# EAGLE design av-streamer-led-hat (EAGLE 9.7.0)
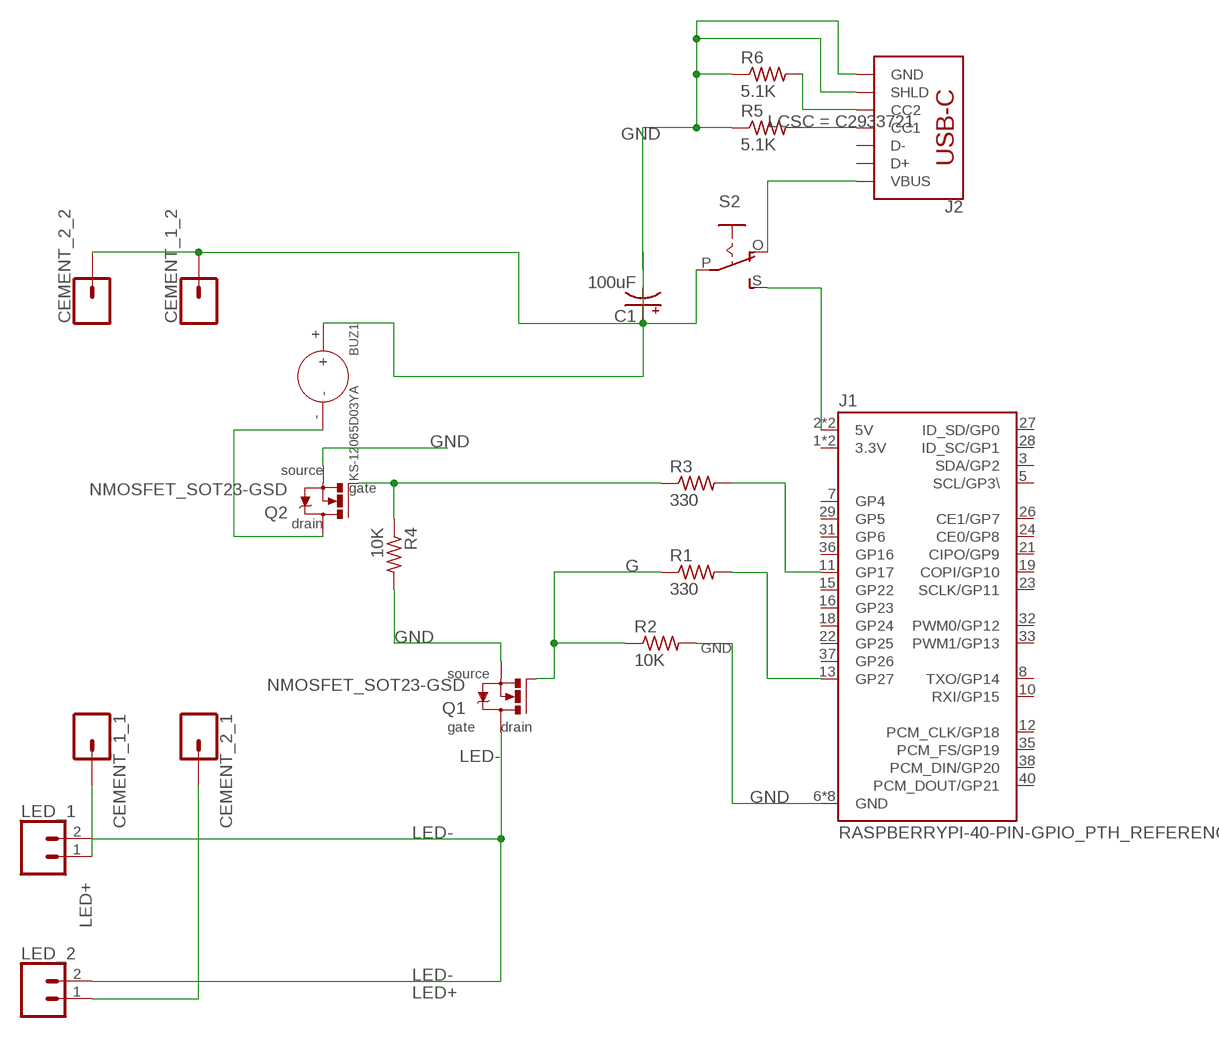
[diagram p0: schematic, sheet 1]

## Parts
BUZ1  KS-12065D03YA  DIP-BUZZER-3V(KS-12065D03YA)  [BZ2-7.6-D12.0XH6.5MM]
C1  100uF  100UF-POLAR-RADIAL-2.5MM-25V-20%  [CPOL-RADIAL-2.5MM-6.5MM]
CEMENT_1_1  CONN_01  [1X01]
CEMENT_1_2  CONN_01  [1X01]
CEMENT_2_1  CONN_01  [1X01]
CEMENT_2_2  CONN_01  [1X01]
J1  RASPBERRYPI-40-PIN-GPIO_PTH_REFERENCE  [RASPBERRY_PI_HAT_40_PIN_PTH_WITH_REFERNCE]
J2  USB_C_2-LAYER_PADS  [USB-C-16P-2LAYER-PADS]
LED_1  CONN_02  [1X02]
LED_2  CONN_02  [1X02]
Q1  NMOSFET_SOT23-GSD  [SOT23]
Q2  NMOSFET_SOT23-GSD  [SOT23]
R1  330  R-US_R1206  [R1206]
R2  10K  R-US_R1206  [R1206]
R3  330  R-US_R1206  [R1206]
R4  10K  R-US_R1206  [R1206]
R5  5.1K  R-US_R1206  [R1206]
R6  5.1K  R-US_R1206  [R1206]
S2  EG1218S  [EG1218]

## Nets
G [LED]: Q1.1(G) R1.1 R2.1
GND [POWER]: C1.2(-) J1.6(GND) J1.9(GND) J1.14(GND) J1.20(GND) J1.25(GND) J1.30(GND) J1.34(GND) J1.39(GND) J2.GND J2.GND2(GND) J2.SHLD1(SHLD) J2.SHLD2(SHLD) J2.SHLD3(SHLD) J2.SHLD4(SHLD) Q1.2(S) Q2.2(S) R2.2 R4.2 R5.1 R6.1
LED+ [LED]: CEMENT_1_1.1 CEMENT_2_1.1 LED_1.1 LED_2.1
LED- [LED]: LED_1.2 LED_2.2 Q1.3(D)
N$1: J1.11(GP17) R3.2
N$3: J1.13(GP27) R1.2
N$4: Q2.1(G) R3.1 R4.1
N$5: J2.A5(CC1) R5.2
N$6: J2.B5(CC2) R6.2
N$7: J2.VBUS1(VBUS) J2.VBUS2(VBUS) S2.O
N$8: J1.2(5V) J1.4(5V) S2.S
N$9 [POWER]: BUZ1.- Q2.3(D)
N$10 [POWER]: BUZ1.+ C1.1(+) CEMENT_1_2.1 CEMENT_2_2.1 S2.P
Unconnected: J1.3(SDA/GP2) J1.5(SCL/GP3\) J1.7(GP4) J1.8(TXO/GP14) J1.10(RXI/GP15) J1.12(PCM_CLK/GP18) J1.15(GP22) J1.16(GP23) J1.18(GP24) J1.19(COPI/GP10) J1.21(CIPO/GP9) J1.22(GP25) J1.23(SCLK/GP11) J1.24(CE0/GP8) J1.26(CE1/GP7) J1.27(ID_SD/GP0) J1.28(ID_SC/GP1) J1.29(GP5) J1.31(GP6) J1.32(PWM0/GP12) J1.33(PWM1/GP13) J1.35(PCM_FS/GP19) J1.36(GP16) J1.37(GP26) J1.38(PCM_DIN/GP20) J1.40(PCM_DOUT/GP21) J2.A6(D+) J2.A7(D-) J2.B6(D+) J2.B7(D-)

## Notes on the sheet
- source
- gate
- drain
- source
- gate | drain

## Power pins joined to a net without a drawn wire
3.3V: J1.1(3.3V) J1.17(3.3V)

## Library data of the parts
BUZ1 = OPL_Connector:DIP-BUZZER-3V(KS-12065D03YA): 312010004; MPN: KS-12065D03YA
C1 = SparkFun-Capacitors:100UF-POLAR: 100µF polarized capacitors A capacitor is a passive two-terminal electrical component used to store electrical energy temporarily in an electric field.; PROD_ID: CAP-08439
CEMENT_1_1 CEMENT_1_2 CEMENT_2_1 CEMENT_2_2 = SparkFun-Connectors:CONN_01: Single connection point. Often used as Generic Header-pin footprint for 0.1 inch spaced/style header connections On any of the 0.1 inch spaced packages, you can populate with these: Break Away Headers - Straight <https://www.sparkfun.com/products/116> (PRT-00116) Break Away Male Headers - Right Angle <https://www.sparkfun.com/products/553> (PRT-00553) Female Headers <https://www.sparkfun.com/products/115> (PRT-00115) Break Away Headers - Machine Pin <https://www.sparkfun.com/products/117> (PRT-00117) Break Away Female Headers - Swiss Machine Pin <https://www.sparkfun.com/products/743> (PRT-00743) This device is also useful as a general connection point to wire up your design to another part of your project. Our various solder wires solder well into these plated through hole pads. Hook-Up Wire - Assortment (Stranded, 22 AWG) <https://www.sparkfun.com/products/11375> (PRT-11375) Hook-Up Wire - Assortment (Solid Core, 22 AWG) <https://www.sparkfun.com/products/11367> (PRT-11367) View the entire wire category on our website here <https://www.sparkfun.com/categories/141> Special notes: SMTSO-256-ET is a "flush mount" nut for a 4-40 screw. We mostly use this on specialty testbeds; it is a nice way to connect hardware to your PCB at an adjustable hieght. Also note, the SNAP packages are for using a snappable style connector. We sell a baggie of snaps and they are also used on two LilyPad designs: Snap Assortment - 30 pack (male and female) <https://www.sparkfun.com/products/11347> (DEV-11347) LilyPad Arduino SimpleSnap <https://www.sparkfun.com/products/10941> (DEV-10941) LilyPad SimpleSnap Protoboard <https://www.sparkfun.com/products/10940> (DEV-10940)
J1 = SparkFun-Connectors:RASPBERRYPI-40-PIN-GPIO: Raspberry Pi GPIO Header 2x20 pin connector, as found on B, B+, A+ models. Both shrouded PTH and SMT versions available. SparkFun Products: GPIO Shrouded Header <https://www.sparkfun.com/products/13054>- PTH SparkFun Pi Wedge (Preassembled) <https://www.sparkfun.com/products/13717>
J2 = SparkFun-Connectors:USB_C: USB Type C 16Pin Connector Super Speed pins not available on the 16-pin purely SMD connector so this part is best for USB 2.0 implementations. D1 and D2 are tied together enabling D+/- no matter which way the cable is plugged into the connector. The two channel configuration pins (CC1/2) are exposed. These are normally connected to ground via 5.1k resistors but can be reconfigured for high current/high power applications. **4-LAYER BOARD WARNING!!** If designing 4-layer board, make sure to select the variant _4-LAYER-ISOLATED. The linked footprint (USB-C-16-4LAYER-ISOLATED) includes some very necessary cutout polygons in the inner layers (2 and 15). This prevents the PTH mounting shield legs on the USB connector from electrically connecting any other polygons on the inner layers (usually VCC and GND).; PROD_ID: CONN-14122
LED_1 LED_2 = SparkFun-Connectors:CONN_02: Multi connection point. Often used as Generic Header-pin footprint for 0.1 inch spaced/style header connections On any of the 0.1 inch spaced packages, you can populate with these: Break Away Headers - Straight <https://www.sparkfun.com/products/116> (PRT-00116) Break Away Male Headers - Right Angle <https://www.sparkfun.com/products/553> (PRT-00553) Female Headers <https://www.sparkfun.com/products/115> (PRT-00115) Break Away Headers - Machine Pin <https://www.sparkfun.com/products/117> (PRT-00117) Break Away Female Headers - Swiss Machine Pin <https://www.sparkfun.com/products/743> (PRT-00743) For SCREWTERMINALS and SPRING TERMINALS visit here: Screw Terimnals on SparkFun.com <https://www.sparkfun.com/search/results?term=Screw+Terminals> (5mm/3.5mm/2.54mm spacing) This device is also useful as a general connection point to wire up your design to another part of your project. Our various solder wires solder well into these plated through hole pads. Hook-Up Wire - Assortment (Stranded, 22 AWG) <https://www.sparkfun.com/products/11375> (PRT-11375) Hook-Up Wire - Assortment (Solid Core, 22 AWG) <https://www.sparkfun.com/products/11367> (PRT-11367) View the entire wire category on our website here <https://www.sparkfun.com/categories/141> Special notes: Molex polarized connector foot print use with: PRT-08233 with associated crimp pins and housings. 2.54_SCREWTERM for use with PRT-10571. 3.5mm Screw Terminal footprints for PRT-08084 5mm Screw Terminal footprints for use with PRT-08432
Q1 = Transistor:NMOSFET: N-Channel MOSFET - Generic; CATEGORY: Transistor; DATASHEET: https://www.analog.com/media/en/package-pcb-resources/package/pkg_pdf/ltc-legacy-sot-23/sot3%2005-08-1631%20rev%20d.pdf; DESCRIPTION: Generic N Channel MOSFET SOT23-GSD Package Surface Mount; LCSC: C181090; PACKAGE_SIZE: SOT23; PACKAGE_TYPE: Surface Mount; SUBCATEGORY: MOSFET; TYPE: N-Channel
Q2 = Transistor:NMOSFET: N-Channel MOSFET - Generic; CATEGORY: Transistor; DATASHEET: https://www.analog.com/media/en/package-pcb-resources/package/pkg_pdf/ltc-legacy-sot-23/sot3%2005-08-1631%20rev%20d.pdf; DESCRIPTION: Generic N Channel MOSFET SOT23-GSD Package Surface Mount; PACKAGE_SIZE: SOT23; PACKAGE_TYPE: Surface Mount; SUBCATEGORY: MOSFET; TYPE: N-Channel
R1-R4 = adafruit:R-US_: RESISTOR, American symbol
R5 R6 = adafruit:R-US_: RESISTOR, American symbol; LCSC: C2933721
S2 = adafruit:EG1218: SLIDING SWITCH 0.1" spacing through hole, vertical SPDT slide switch http://www.ladyada.net/library/pcb/eaglelibrary.html

## Net classes
0 default: width 0.25 mm, clearance 0.2 mm
1 POWER: width 1 mm, clearance 0.3 mm
2 LED: width 1 mm, clearance 0.3 mm

## Board
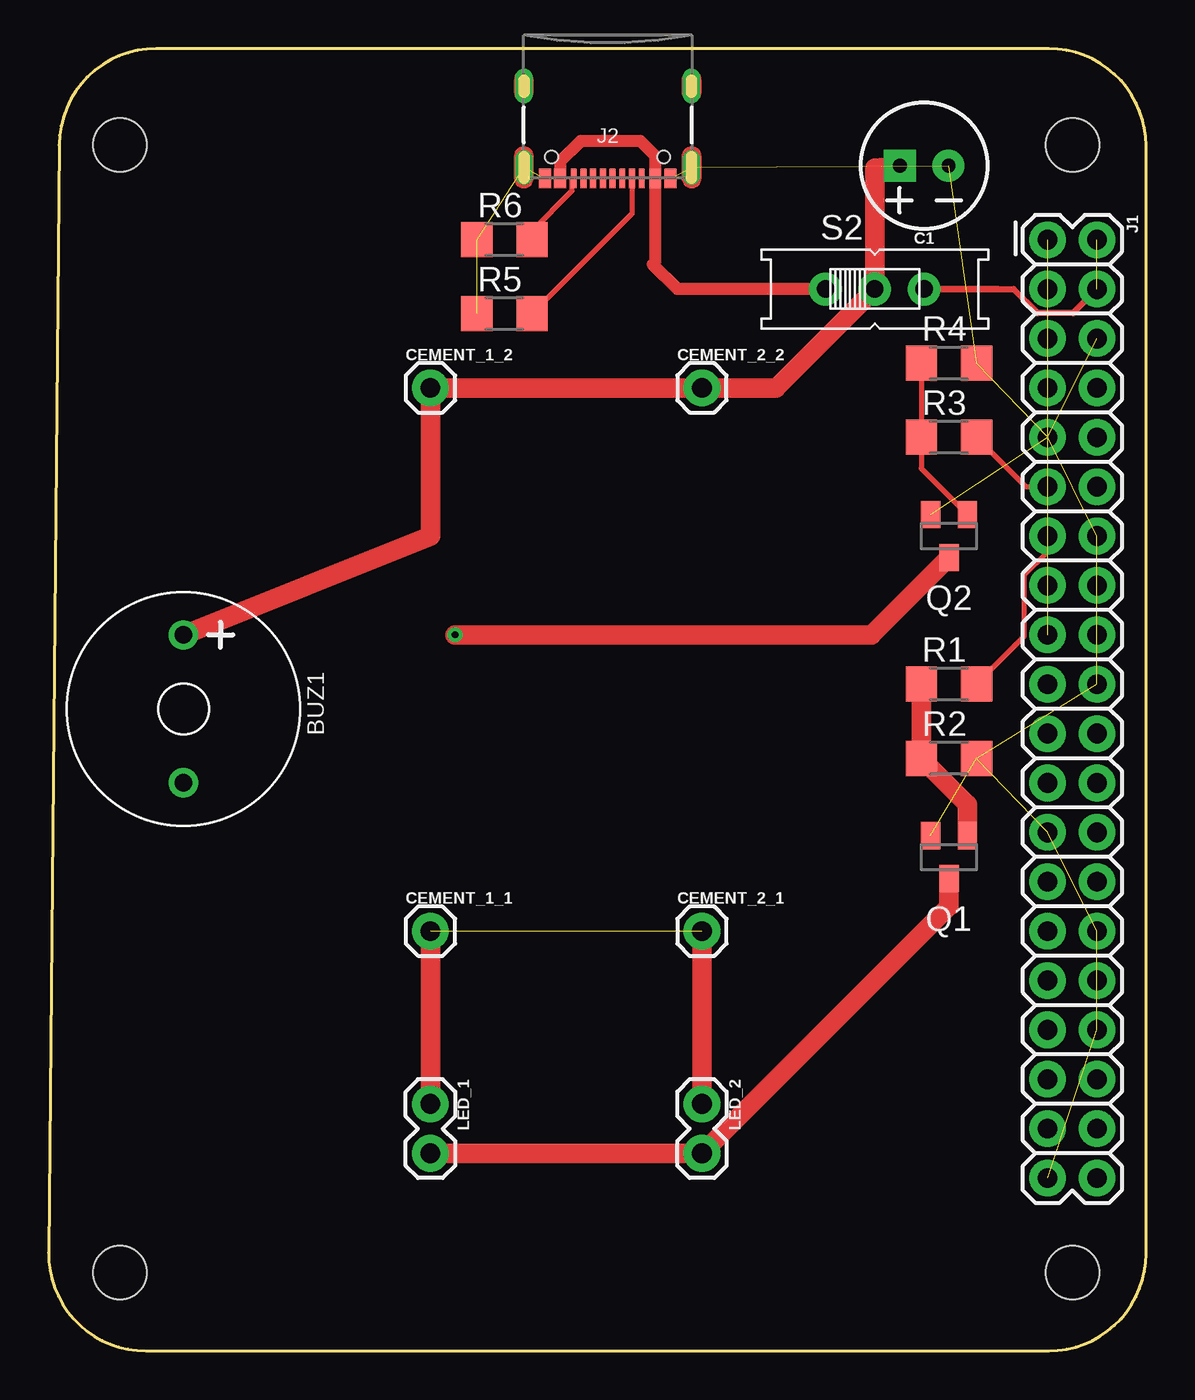
[diagram p1: board, top side]
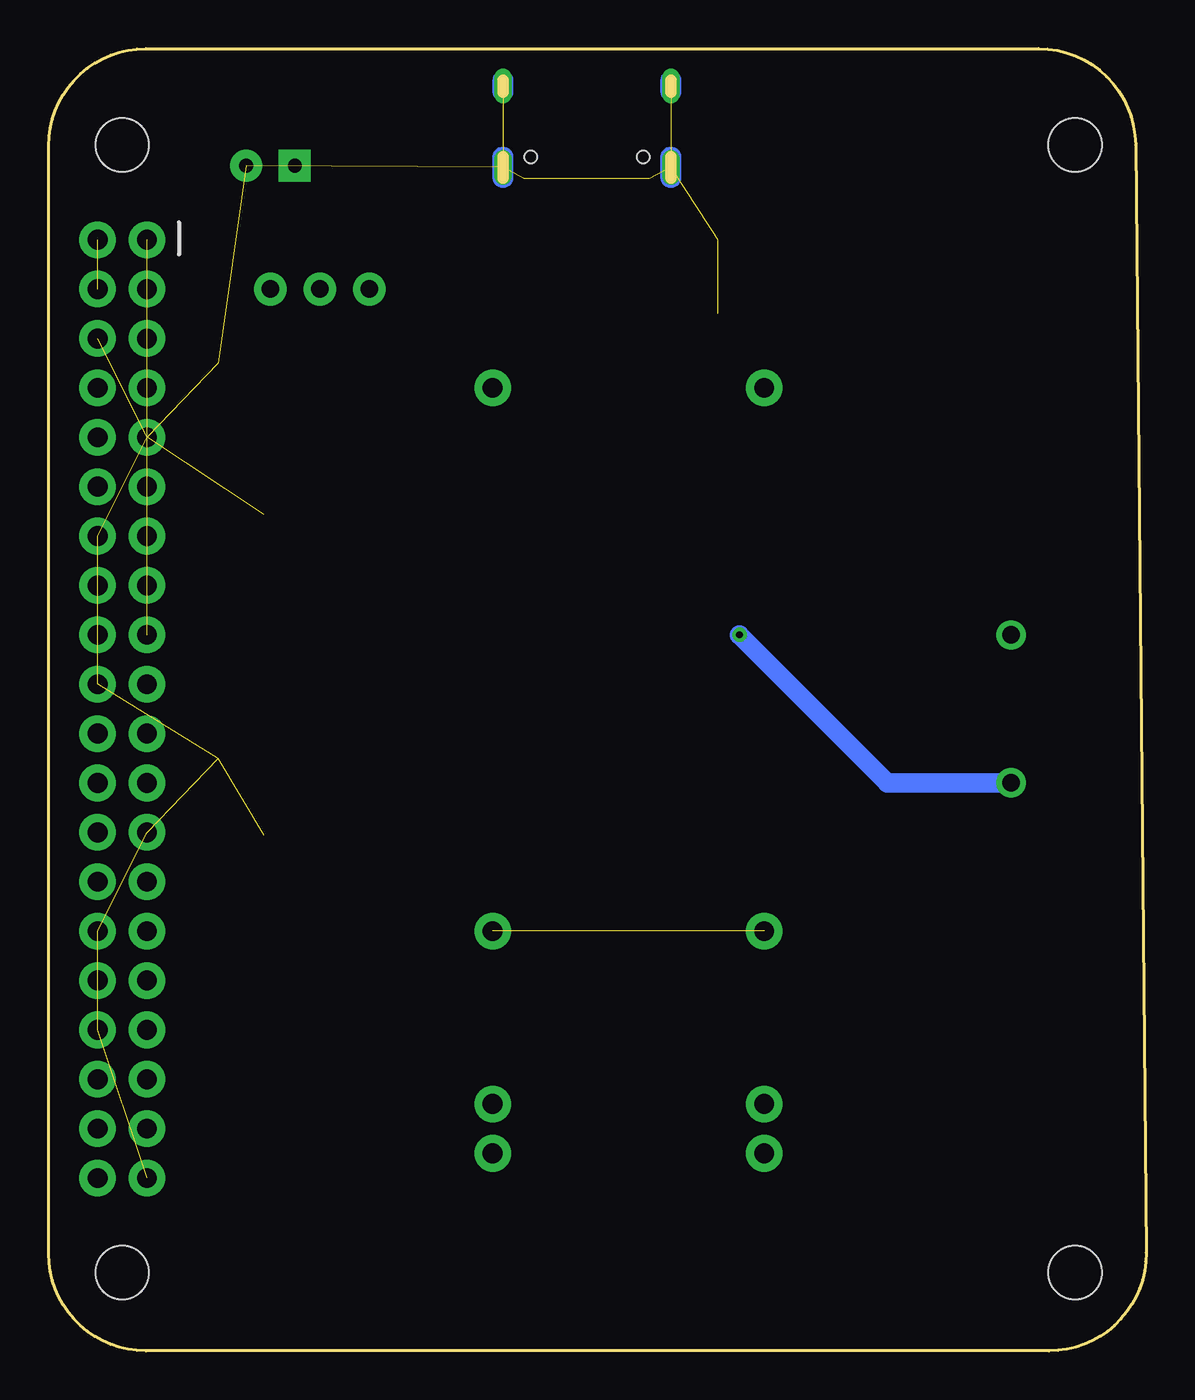
[diagram p2: board, bottom side, seen from below]

Size 56.45 x 66.98 mm. Coordinates in mm from the lower left corner, seen from the top.
Outline: 51.45,0 arc90 56.45,5 56.45,61.98 arc90 51.45,66.98 5.54,66.98 arc89 0.54,62.03 0,5.05 arc91 5,0 51.45,0
Copper layers (1*16): Top 0.035mm / dielectric 1.5mm / Bottom 0.035mm
Design rules "Fusion Electronics Design Rules": minimum track width 6mil, minimum drill 0.35mm, track to track 6mil, track to pad 6mil, pad to pad 6mil, via to via 6mil, smd to smd 6mil, copper to edge 40mil, drill to drill 6mil, minimum pad ring 10mil, minimum via ring 8mil, stop-mask expansion 4mil, vias tented up to drill 9999mil, thermal gap 10mil

### Footprints (pad centres in the part's own frame; a part is rotated, then mirrored left to right if it is on the bottom)
BZ2-7.6-D12.0XH6.5MM = drill 0.9 pad 1.5: + -3.8,0; - 3.8,0
CPOL-RADIAL-2.5MM-6.5MM = drill 0.7 pad 1.651 square: 1 1.25,0 | drill 0.7 pad 1.651: 2 -1.25,0
1X01 = drill 1.016 pad 1.88: 1 0,0
RASPBERRY_PI_HAT_40_PIN_PTH_WITH_REFERNCE = drill 1.016 pad 1.88: 1 0,0; 2 0,2.54; 3 2.54,0; 4 2.54,2.54; 5 5.08,0; 6 5.08,2.54; 7 7.62,0; 8 7.62,2.54; 9 10.16,0; 10 10.16,2.54; 11 12.7,0; 12 12.7,2.54; 13 15.24,0; 14 15.24,2.54; 15 17.78,0; 16 17.78,2.54; 17 20.32,0; 18 20.32,2.54; 19 22.86,0; 20 22.86,2.54; 21 25.4,0; 22 25.4,2.54; 23 27.94,0; 24 27.94,2.54; 25 30.48,0; 26 30.48,2.54; 27 33.02,0; 28 33.02,2.54; 29 35.56,0; 30 35.56,2.54; 31 38.1,0; 32 38.1,2.54; 33 40.64,0; 34 40.64,2.54; 35 43.18,0; 36 43.18,2.54; 37 45.72,0; 38 45.72,2.54; 39 48.26,0; 40 48.26,2.54 | hole 2.75: -4.87,-47.727; 53.13,-47.727; 53.13,1.273; -4.87,1.273
USB-C-16P-2LAYER-PADS = smd 0.3 x 1: A5 -1.25,-0.34; A6 -0.25,-0.34; A7 0.25,-0.34; A8 1.25,-0.34; B5 1.75,-0.34; B6 0.75,-0.34; B7 -0.75,-0.34; B8 -1.75,-0.34 | smd 0.6 x 1: GND -3.225,-0.34; GND2 3.225,-0.34; VBUS1 -2.45,-0.34; VBUS2 2.45,-0.34 | drill 0.4 pad 0.6 long: SHLD1 -4.318,-0.915; SHLD2 4.318,-0.915; SHLD3 -4.318,-5.095; SHLD4 4.318,-5.095 | hole 0.65: -2.89,-1.445; 2.89,-1.445
1X02 = drill 1.016 pad 1.88: 1 0,0; 2 2.54,0
SOT23 = smd 1 x 1.4: 1 -0.95,-1.1; 2 0.95,-1.1; 3 0,1.1
R1206 = smd 1.6 x 1.803: 1 -1.422,0; 2 1.422,0
EG1218 = drill 0.9 pad 1.676: O -2.54,0; P 0,0; S 2.54,0

### Placement (x,y rotation side)
BUZ1  6.94,33.02 270 top
C1  45.04,60.96 180 top
CEMENT_1_1  19.64,21.59 0 top
CEMENT_1_2  19.64,49.53 0 top
CEMENT_2_1  33.61,21.59 0 top
CEMENT_2_2  33.61,49.53 0 top
J1  51.39,57.15 270 top
J2  28.76,59.96 180 top
LED_1  19.64,12.7 270 top
LED_2  33.61,12.7 270 top
Q1  46.31,25.4 180 top
Q2  46.31,41.91 180 top
R1  46.31,34.29 0 top
R2  46.31,30.48 0 top
R3  46.31,46.99 0 top
R4  46.31,50.8 0 top
R5  23.45,53.34 0 top
R6  23.45,57.15 0 top
S2  42.5,54.61 0 top

### Tracks (layer width: path | path; a pad name or v marks a point on that pad's centre or on a via)
3.3V  (1 unrouted)
G
  Top 1: R1.1 R2.1 47.26,28.11 Q1.1
GND  (20 unrouted)
LED+  (1 unrouted)
  Top 1: CEMENT_1_1.1 LED_1.1 | CEMENT_2_1.1 LED_2.1
LED-
  Top 1: LED_1.2 LED_2.2 46.31,22.86 Q1.3
N$1
  Top 0.25: R3.2 50.27,44.45 J1.11
N$3
  Top 0.25: R1.2 50.17,36.73 50.17,39.87 51.39,41.09 J1.13
N$4
  Top 0.25: R4.1 R3.1 44.89,45.38 Q2.1
N$5
  Top 0.25: J2.A5 30.01,58.48 R5.2
N$6
  Top 0.25: J2.B5 26.93,60.23 26.93,59.67 24.87,57.6 R6.2
N$7
  Top 0.61: S2.O 32.34,54.61 31.07,55.88 31.21,56.02 J2.VBUS1 31.21,61.45 30.43,62.23 27.37,62.23 26.31,61.17 J2.VBUS2
N$8  (1 unrouted)
  Top 0.305: 48.85,54.61 S2.S 49.63,54.61 50.87,53.36 51.39,53.36 52.68,53.36 J1.4
N$9  (via drill 0.35)
  Top 1: Q2.3 42.33,36.83 v20.91,36.83
  Bottom 1: v20.91,36.83 13.3,29.22 BUZ1.-
N$10
  Top 1: C1.1 42.5,60.82 S2.P 37.42,49.53 CEMENT_2_2.1 CEMENT_1_2.1 19.64,41.92 BUZ1.+